# Altium schematic sheet USB_Connector.SchDoc: RP2040 CNC
size B; Author: AM; CompanyName: Expatria Technologies; DrawnBy: A.Marles; Engineer: AM; Organization: Expatria Technolgoies; Address1: PO Box 2084; Address3: Merritt, BC V1K 1B8; Address4: Canada; DocumentNumber: 25; SheetNumber: 25; SheetTotal: 27
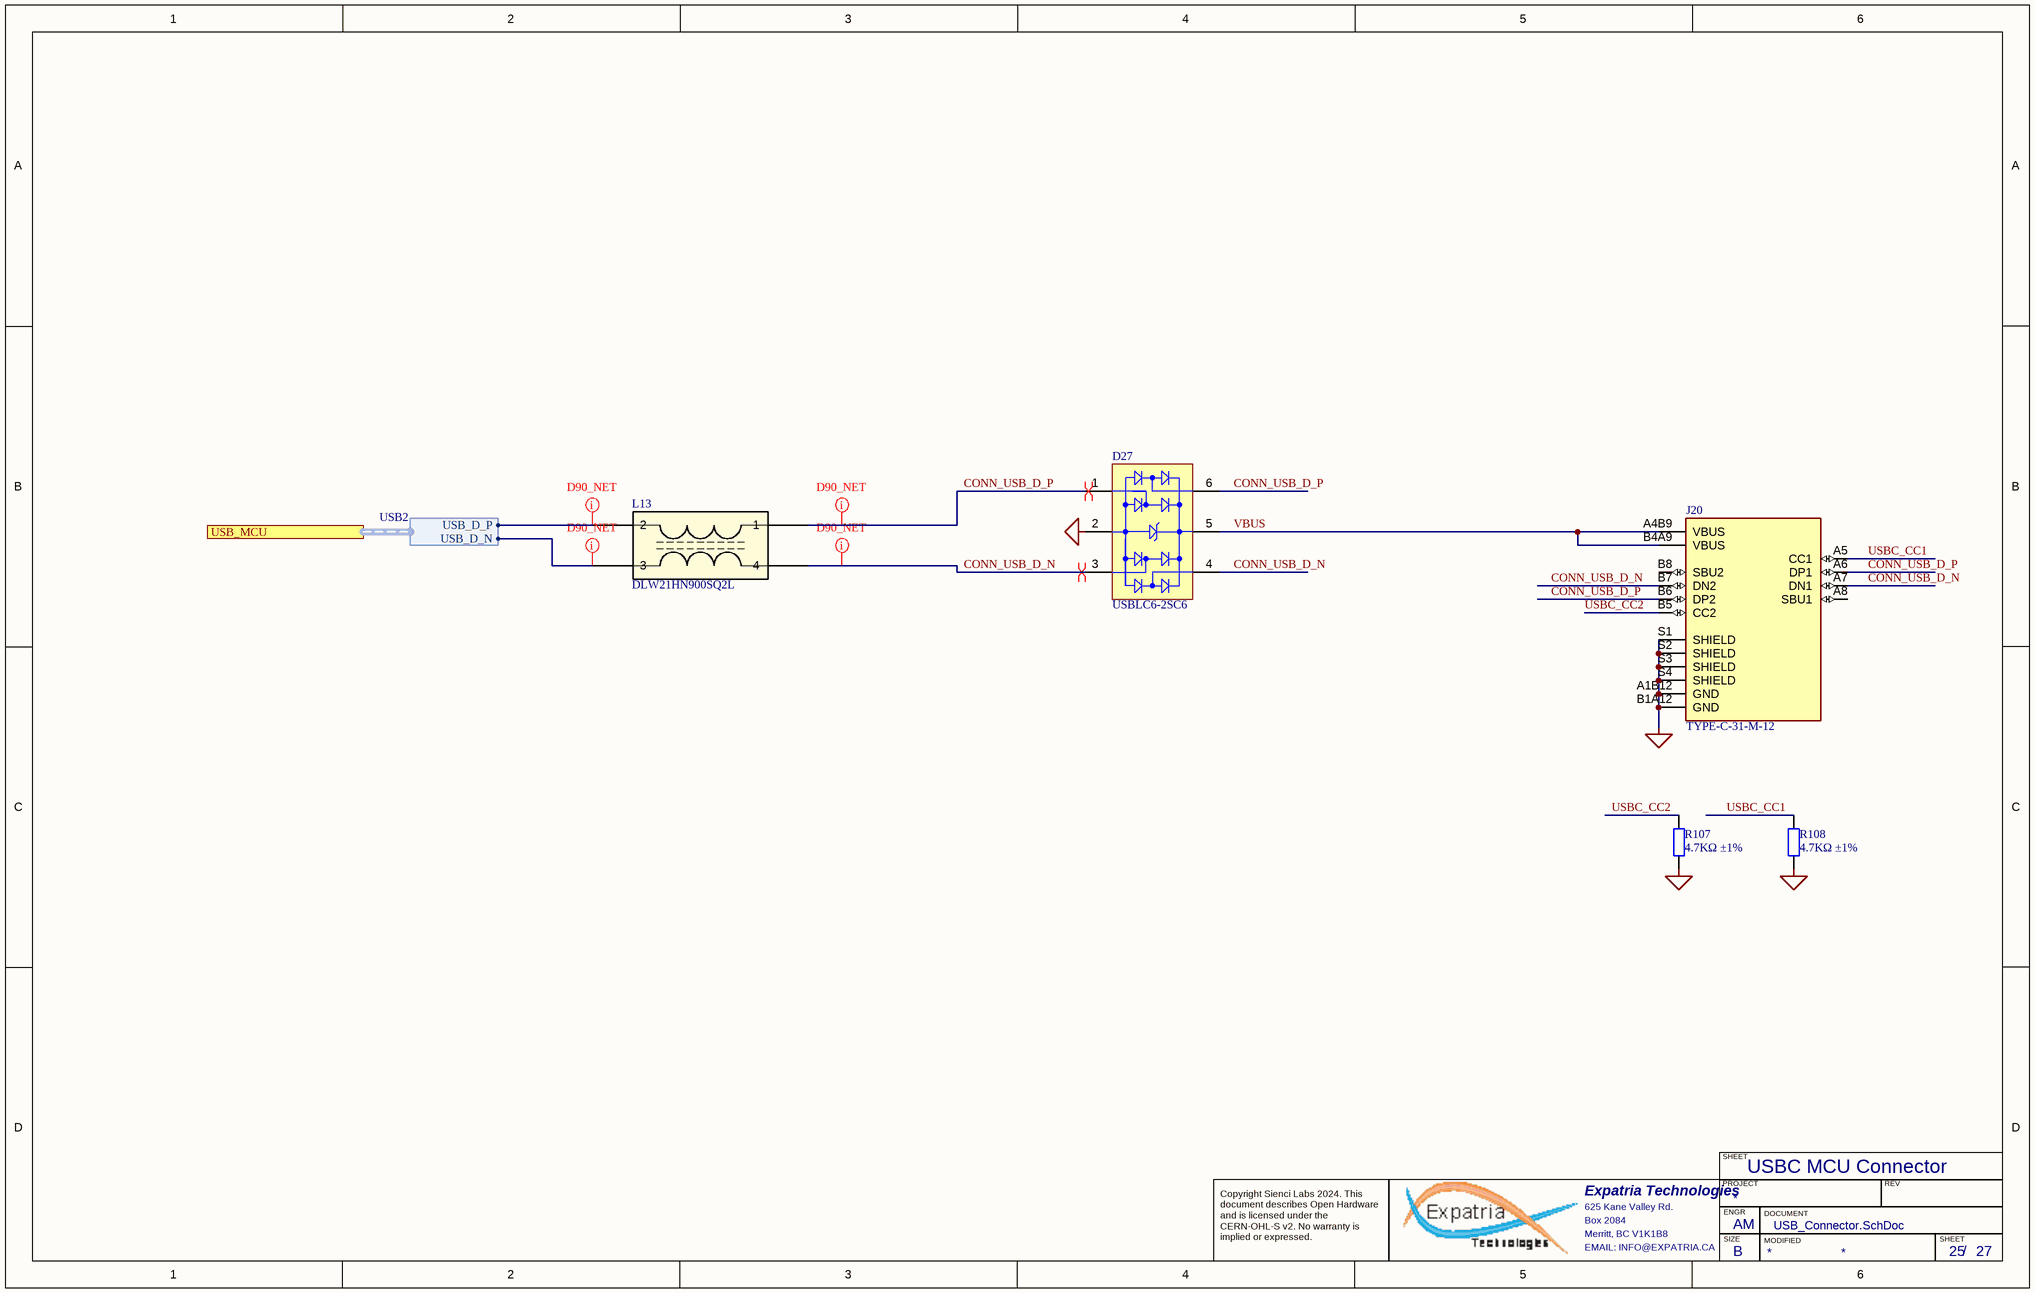
[diagram p0: USB_Connector.SchDoc]

## Parts
D27  USBLC6-2SC6  [SOT95P280X145-6N]
J20  TYPE-C-31-M-12  [HRO_TYPE-C-31-M-12]
L13  DLW21HN900SQ2L  [DLW21HN121HQ2B]
R107  4.7KΩ ±1%  [0603_R]
R108  4.7KΩ ±1%  [0603_R]

## Ports
USB_MCU (harness USB2)

## Harnesses
USB2: USB_D_P, USB_D_N

## Nets
MCU_GND: D27.2(GND) J20.A1B12(GND) J20.B1A12(GND) J20.S1(SHIELD) J20.S2(SHIELD) J20.S3(SHIELD) J20.S4(SHIELD) R107.2 R108.2
CONN_USB_D_N: D27.3(I/O_2) D27.4(I/O_3) J20.A7(DN1) J20.B7(DN2) L13.4
CONN_USB_D_P: D27.1(I/O_1) D27.6(I/O_4) J20.A6(DP1) J20.B6(DP2) L13.1
USBC_CC1: J20.A5(CC1) R108.1
USBC_CC2: J20.B5(CC2) R107.1
VBUS: D27.5(VBUS) J20.A4B9(VBUS) J20.B4A9(VBUS)
NetL13_2: L13.2 ; port USB_MCU.USB_D_P
NetL13_3: L13.3 ; port USB_MCU.USB_D_N

Not connected (* = marked no-connect by the designer): J20 A8(SBU1) B8(SBU2)

## Layout directives
differential pair: CONN_USB_D_N, CONN_USB_D_P
net class D90_NET: CONN_USB_D_N, CONN_USB_D_P, NetL13_2, NetL13_3

## Notes on the sheet
- USBC MCU Connector
- SHEET
- Expatria Technologies
- 625 Kane Valley Rd.
- Box 2084
- Merritt, BC V1K1B8
- PROJECT
- SIZE
- ENGR
- MODIFIED
- DOCUMENT
- REV
- Copyright Sienci Labs 2024. This document describes Open Hardware and is licensed under the CERN-OHL-S v2. No warranty is implied or expressed.
- EMAIL: INFO@EXPATRIA.CA
- B
- /

## Library data of the parts
D27 = USBLC6-2SC6: Very low capacitance ESD protection, 3.5 pF, -40 to 125 degC, 6-Pin SOT23, RoHS, Tape and Reel; Manufacturer: TECH PUBLIC; Polarity: Uni-Directional; Clamping Voltage: 11V; Rad Hardened: No; Product Height (mm): 1.3mm; Leakage Current (Max): 0.15uA; Product Length (mm): 3.05mm; Number of Elements: 1; Peak Pulse Current: 5A; Configuration: Dual; Reverse Breakdown Voltage: 6V; Working Voltage (Max): 5V; Capacitance Value: 3.5pF; Suppressor Type: DiodeArrays; Product Depth (mm): 1.75mm; Test Current (It): 1mA; Package / Case: SOT-23; Operating Temperature Max Deg. C: 125C; Package Description: 6-Pin Small Outline Transistor, Body 2.925 x 1.625 mm, Pitch 0.95 mm; Package Reference: SOT23-6L; Operating Temperature Min Deg. C: -40C; Mounting Style: SurfaceMount; Direction Type: Uni-Directional; Mounting: SurfaceMount; Pin Count: 6; Leakage Current: 0.15uA; Packaging: TapeandReel; Operating Temperature Classification: Automotive; Clamping Voltage (Max): 11V; Reverse Stand-off Voltage: 5V; Datasheet URL: http://www.st.com/st-web-ui/static/active/en/resource/technical/document/datasheet/CD00050750.pdf; Working Voltage: 5V; Operating Temp Range: -40Cto125C; Manufacturer Part Number: USBLC6-2SC6; SuppliersPartNumber: C2827654; Supplier: LCSC
J20 = TYPE-C-31-M-12: USB Connectors 24 Receptacle 1 8.94*7.3mm RoHS; Manufacturer: HRO Electronics Co., Ltd.; Value: TYPE-C-31-M-12; SnapEDA_Link: https://www.snapeda.com/parts/TYPE-C-31-M-12/HRO%20Electronics%20Co.,%20Ltd./view-part/3228496/?ref=snap; Package: Package; Manufacturer Part Number: TYPE-C-31-M-12; SuppliersPartNumber: C2765186; Supplier: LCSC
L13 = DLW21HN900SQ2L: 90Ω@100MHz -40℃~+85℃ 350mΩ 50V 2 330mA 125V SMD-4P Common Mode Filters ROHS; Manufacturer: Murata Electronics; SuppliersPartNumber: C80529; Manufacturer Part Number: DLW21HN900SQ2L; Supplier: LCSC; Value: DLW21HN900SQ2L
R107 R108 = 0603 4.7K (4701) 1%: Chip resistor; Manufacturer: Uniroyal Elec; Manufacturer Part Number: 0603WAF4701T5E; Power: 1/10W; ComponentLink1Description: Supplier link; ComponentLink1URL: http://www.szlcsc.com/product/details_23889.html; Package: 0603; Supplier: LCSC; SuppliersPartNumber: C23162; Resistance: 4.7KΩ; Tolerance: 1%